# EAGLE design bucket (EAGLE 7.6.0)
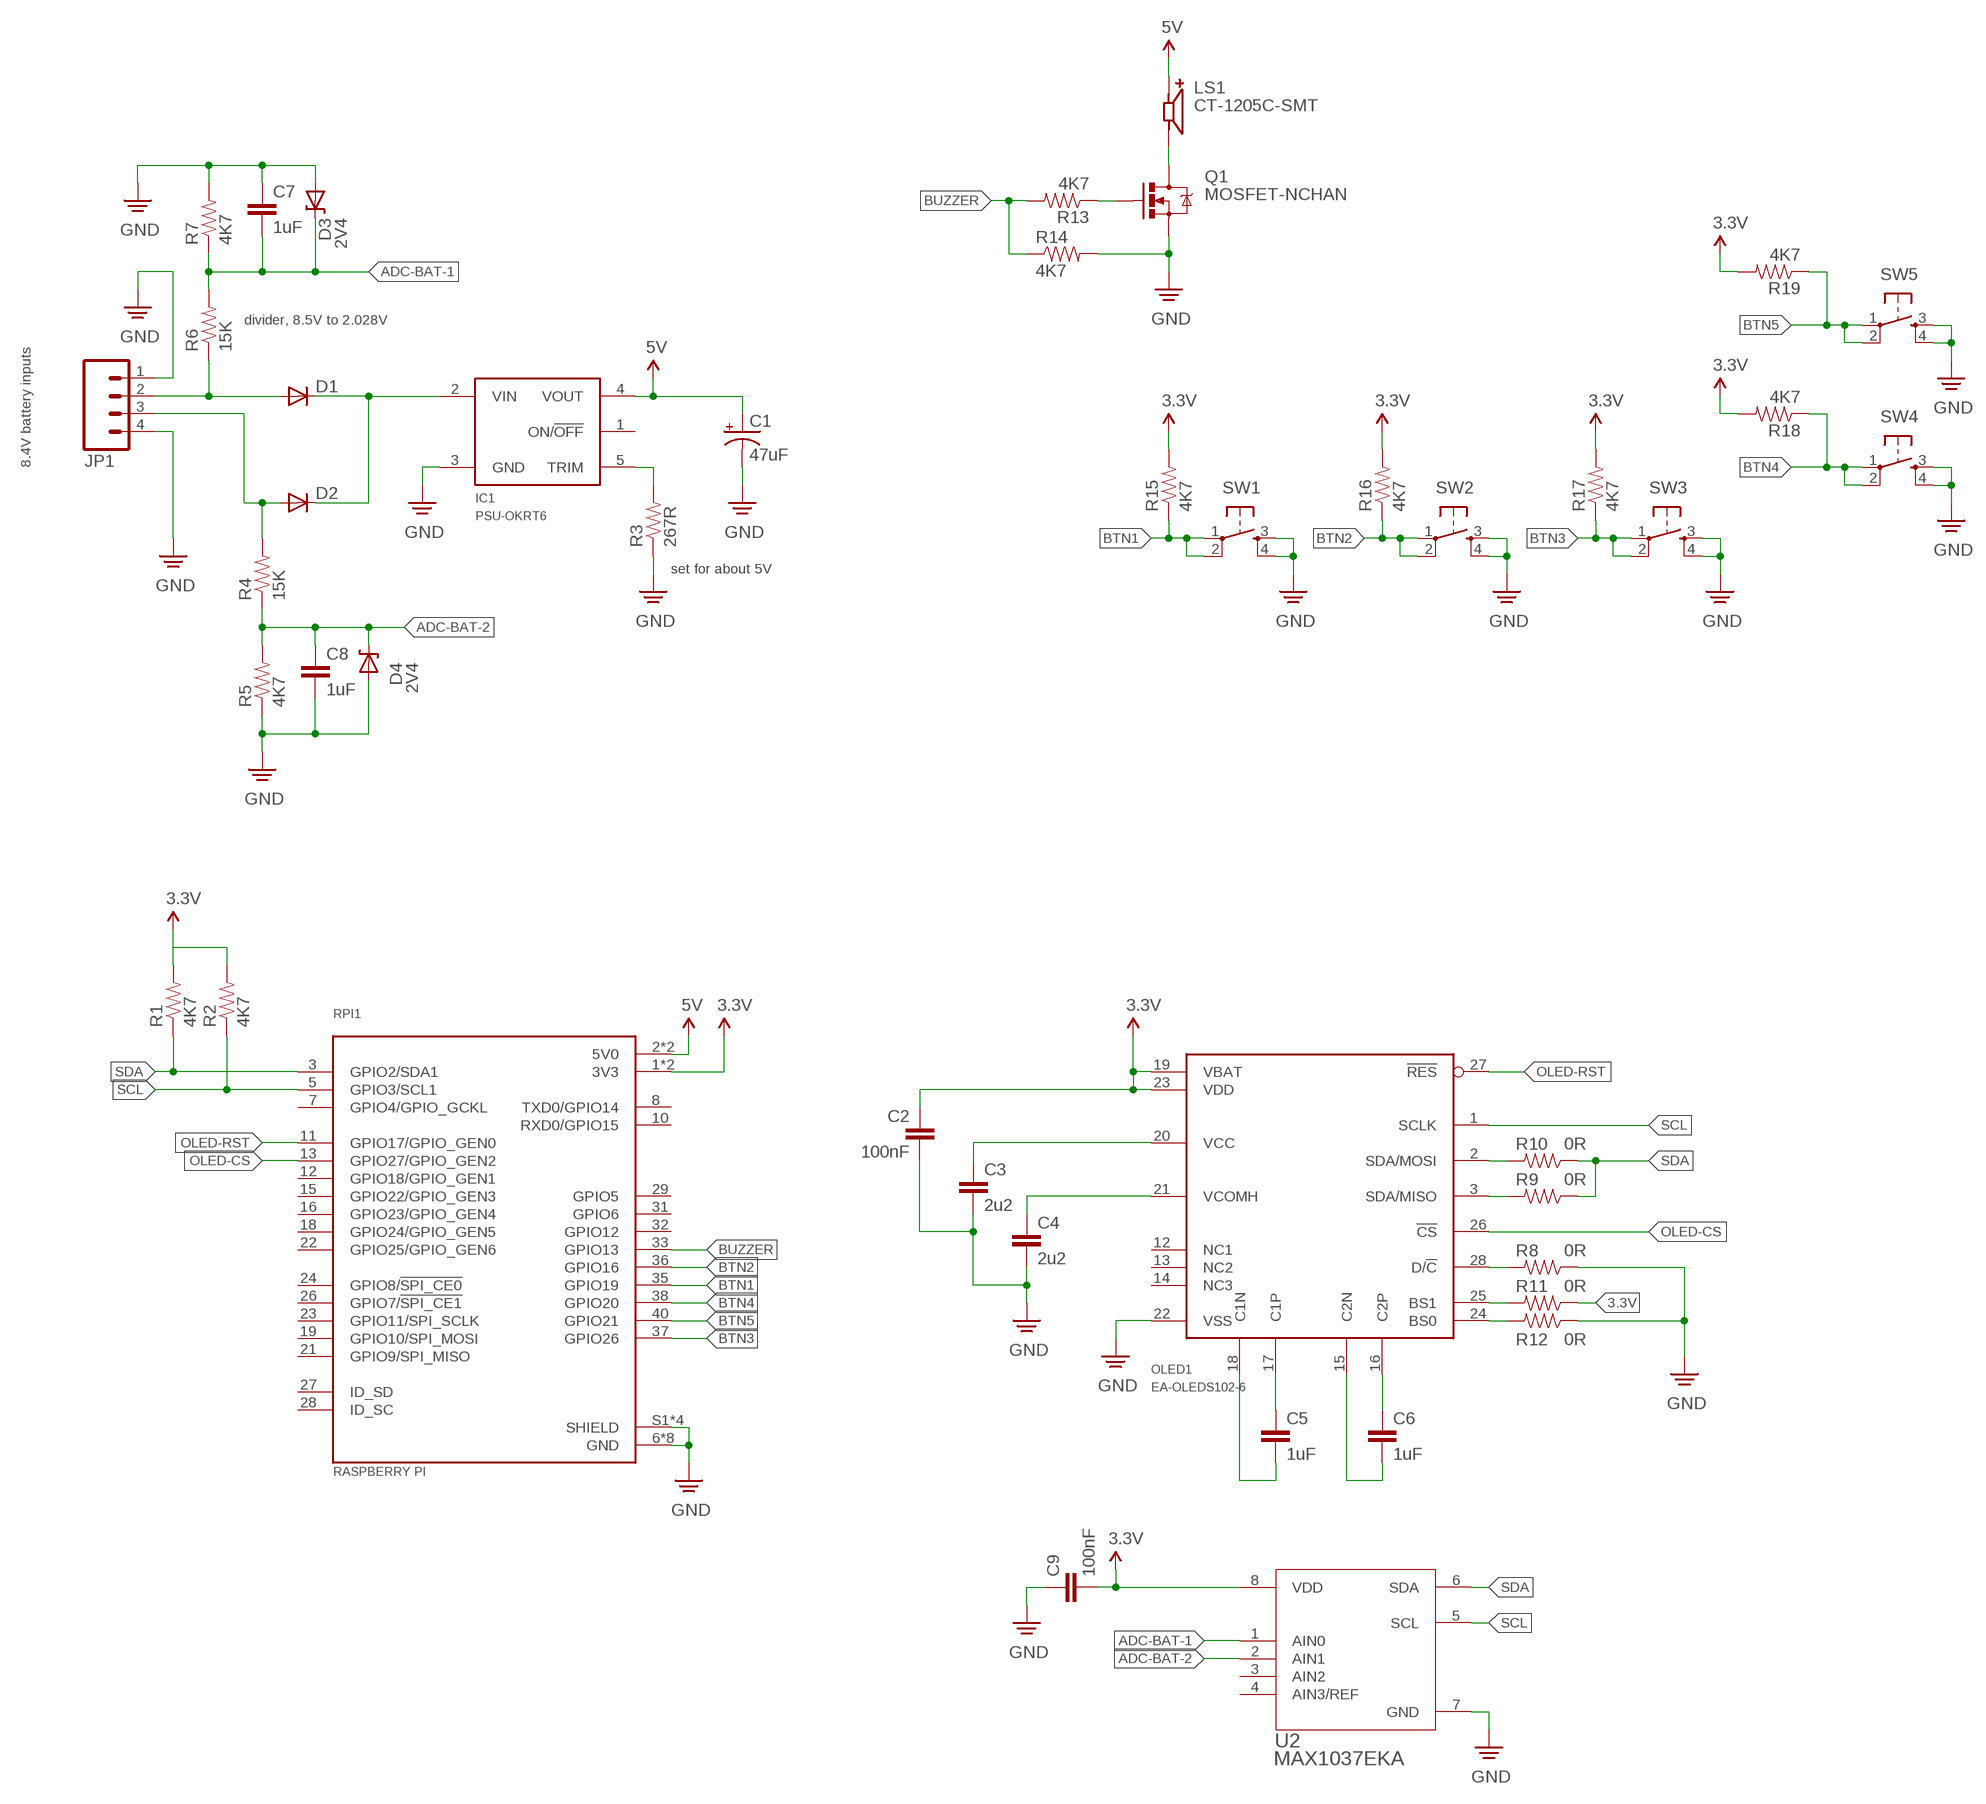
[diagram p0: schematic, sheet 1]

## Parts
C1  47uF  CAP_POLD  [PANASONIC_D]
C2  100nF  CAP0603-CAP  [0603-CAP]
C3  2u2  CAP0603-CAP  [0603-CAP]
C4  2u2  CAP0603-CAP  [0603-CAP]
C5  1uF  CAP0603-CAP  [0603-CAP]
C6  1uF  CAP0603-CAP  [0603-CAP]
C7  1uF  CAP0603-CAP  [0603-CAP]
C8  1uF  CAP0603-CAP  [0603-CAP]
C9  100nF  CAP0603-CAP  [0603-CAP]
D1  DIODESMB  [SMB-DIODE]
D2  DIODESMB  [SMB-DIODE]
D3  2V4  DIODE-ZENER-SOD323  [SOD-323]
D4  2V4  DIODE-ZENER-SOD323  [SOD-323]
IC1  PSU-OKRT6  [PSU-OKRT6]
JP1  M04-AMPMODUMTE-TH-ANG  [M04-AMPMODUMTE-TH-ANG]
LS1  CT-1205C-SMT  [CUI_CT-1205C-SMT]
OLED1  EA-OLEDS102-6  [EA-OLEDS102-6]
Q1  MOSFET-NCHAN  MOSFET-NCHANNELSMD  [SOT23-3]
R1  4K7  RESISTOR0603-RES  [0603-RES]
R2  4K7  RESISTOR0603-RES  [0603-RES]
R3  267R  RESISTOR0603-RES  [0603-RES]
R4  15K  RESISTOR0603-RES  [0603-RES]
R5  4K7  RESISTOR0603-RES  [0603-RES]
R6  15K  RESISTOR0603-RES  [0603-RES]
R7  4K7  RESISTOR0603-RES  [0603-RES]
R8  0R  RESISTOR0603-RES  [0603-RES]
R9  0R  RESISTOR0603-RES  [0603-RES]
R10  0R  RESISTOR0603-RES  [0603-RES]
R11  0R  RESISTOR0603-RES  [0603-RES]
R12  0R  RESISTOR0603-RES  [0603-RES]
R13  4K7  RESISTOR0603-RES  [0603-RES]
R14  4K7  RESISTOR0603-RES  [0603-RES]
R15  4K7  RESISTOR0603-RES  [0603-RES]
R16  4K7  RESISTOR0603-RES  [0603-RES]
R17  4K7  RESISTOR0603-RES  [0603-RES]
R18  4K7  RESISTOR0603-RES  [0603-RES]
R19  4K7  RESISTOR0603-RES  [0603-RES]
RPI1  RASPBERRY PI  RASPBERRY_PI_3_MODEL_B+  [MODULE_RASPBERRY_PI_3_MODEL_B+]
SW1  TAC_SWITCHPTH  [TACTILE-PTH]
SW2  TAC_SWITCHPTH  [TACTILE-PTH]
SW3  TAC_SWITCHPTH  [TACTILE-PTH]
SW4  TAC_SWITCHPTH  [TACTILE-PTH]
SW5  TAC_SWITCHPTH  [TACTILE-PTH]
U2  MAX1037EKA  [21-0078H]

## Nets
3.3V: C2.1 C9.2 OLED1.19(VBAT) OLED1.23(VDD) R1.2 R2.2 R11.1 R15.2 R16.2 R17.2 R18.2 R19.2 RPI1.1(3V3) RPI1.17(3V3) U2.8(VDD)
5V: C1.+ IC1.4(VOUT) LS1.1 RPI1.2(5V0) RPI1.4(5V0)
ADC-BAT-1: C7.2 D3.1(C) R6.2 R7.1 U2.1(AIN0)
ADC-BAT-2: C8.1 D4.1(C) R4.1 R5.2 U2.2(AIN1)
BTN1: R15.1 RPI1.35(GPIO19) SW1.1 SW1.2
BTN2: R16.1 RPI1.36(GPIO16) SW2.1 SW2.2
BTN3: R17.1 RPI1.37(GPIO26) SW3.1 SW3.2
BTN4: R18.1 RPI1.38(GPIO20) SW4.1 SW4.2
BTN5: R19.1 RPI1.40(GPIO21) SW5.1 SW5.2
BUZZER: R13.2 R14.1 RPI1.33(GPIO13)
GND: C1.- C2.2 C3.2 C4.2 C7.1 C8.2 C9.1 D3.2(A) D4.2(A) IC1.3(GND) JP1.1 JP1.4 OLED1.22(VSS) Q1.2(S) R3.1 R5.1 R7.2 R8.1 R12.1 R14.2 RPI1.6(GND) RPI1.9(GND) RPI1.14(GND) RPI1.20(GND) RPI1.25(GND) RPI1.30(GND) RPI1.34(GND) RPI1.39(GND) RPI1.S1(SHIELD) RPI1.S2(SHIELD) RPI1.S3(SHIELD) RPI1.S4(SHIELD) SW1.3 SW1.4 SW2.3 SW2.4 SW3.3 SW3.4 SW4.3 SW4.4 SW5.3 SW5.4 U2.7(GND)
N$1: D2.A JP1.3 R4.2
N$2: D1.A JP1.2 R6.1
N$3: D1.C D2.C IC1.2(VIN)
N$4: IC1.5(TRIM) R3.2
N$5: Q1.1(G) R13.1
N$6: LS1.2 Q1.3(D)
N$7: OLED1.28(D/!C) R8.2
N$9: OLED1.3(SDA/MISO) R9.2
N$10: OLED1.2(SDA/MOSI) R10.2
N$11: OLED1.25(BS1) R11.2
N$12: OLED1.24(BS0) R12.2
N$13: C4.1 OLED1.21(VCOMH)
N$14: C3.1 OLED1.20(VCC)
N$16: C5.2 OLED1.18(C1N)
N$17: C5.1 OLED1.17(C1P)
N$18: C6.1 OLED1.16(C2P)
N$19: C6.2 OLED1.15(C2N)
OLED-CS: OLED1.26(!CS) RPI1.13(GPIO27/GPIO_GEN2)
OLED-RST: OLED1.27(!RES) RPI1.11(GPIO17/GPIO_GEN0)
SCL: OLED1.1(SCLK) R2.1 RPI1.5(GPIO3/SCL1) U2.5(SCL)
SDA: R1.1 R9.1 R10.1 RPI1.3(GPIO2/SDA1) U2.6(SDA)
Unconnected: IC1.1(ON/!OFF) OLED1.12(NC1) OLED1.13(NC2) OLED1.14(NC3) RPI1.7(GPIO4/GPIO_GCKL) RPI1.8(TXD0/GPIO14) RPI1.10(RXD0/GPIO15) RPI1.12(GPIO18/GPIO_GEN1) RPI1.15(GPIO22/GPIO_GEN3) RPI1.16(GPIO23/GPIO_GEN4) RPI1.18(GPIO24/GPIO_GEN5) RPI1.19(GPIO10/SPI_MOSI) RPI1.21(GPIO9/SPI_MISO) RPI1.22(GPIO25/GPIO_GEN6) RPI1.23(GPIO11/SPI_SCLK) RPI1.24(GPIO8/!SPI_CE0!) RPI1.26(GPIO7/!SPI_CE1!) RPI1.27(ID_SD) RPI1.28(ID_SC) RPI1.29(GPIO5) RPI1.31(GPIO6) RPI1.32(GPIO12) U2.3(AIN2) U2.4(AIN3/REF)

## Notes on the sheet
- divider, 8.5V to 2.028V
- 8.4V battery inputs
- set for about 5V

## Library data of the parts
C1 = bucket:CAP_POL: Capacitor Polarized These are standard SMD and PTH capacitors. Normally 10uF, 47uF, and 100uF in electrolytic and tantalum varieties. Always verify the external diameter of the through hole cap, it varies with capacity, voltage, and manufacturer. The EIA devices should be standard.
C2-C9 = bucket:CAP: Capacitor Standard 0603 ceramic capacitor, and 0.1" leaded capacitor.
D1 D2 = bucket:DIODE: Diode These are standard reverse protection diodes and small signal diodes. SMA package can handle up to about 1A. SOD-323 can handle about 200mA. What the SOD-323 package when ordering, there are some mfgs out there that are 5-pin packages.
D3 D4 = bucket:DIODE-ZENER: Zener Diode Production Part - 8199 3.4V Zener Voltage
IC1 = bucket:PSU-OKRT6
JP1 = bucket:M04: Header 4 Standard 4-pin 0.1" header. Use with straight break away headers (SKU : PRT-00116), right angle break away headers (PRT-00553), swiss pins (PRT-00743), machine pins (PRT-00117), and female headers (PRT-00115). Molex polarized connector foot print use with SKU : PRT-08231 with associated crimp pins and housings. 1MM SMD Version SKU: PRT-10208
LS1 = bucket:CT-1205C-SMT: 12.8 mm, 5 V, 90 dB, 2.4 kHz, Surface Mount (SMT), Driving Circuit, Magnetic Audio Indicator Buzzer; DESCRIPTION: 12.8 mm, 5 V, 90 dB, 2.4 kHz, Surface Mount (SMT), Driving Circuit, Magnetic Audio Indicator Buzzer; MF: CUI DEVICES; MP: CT-1205C-SMT; PACKAGE: None
OLED1 = bucket:EA-OLEDS102-6
Q1 = bucket:MOSFET-NCHANNEL
R1-R19 = bucket:RESISTOR: Resistor Basic schematic elements and footprints for 0603, 1206, and PTH resistors.
RPI1 = bucket:RASPBERRY_PI_3_MODEL_B+: BCM2835 Raspberry Pi Model B+
SW1-SW5 = bucket:TAC_SWITCH: Momentary Switch Button commonly used for reset or general input. Spark Fun Electronics SKU : COM-00097
U2 = bucket:MAX1037EKA; DESCRIPTION: Analog to Digital Converters - ADC 2.7V to 5.5V, Low-Power, 4-/12-Channel 2-Wire Serial 8-Bit ADCs; MF: Maxim Integrated; MP: MAX1037EKA; PACKAGE: SOT-8 Maxim

## Board
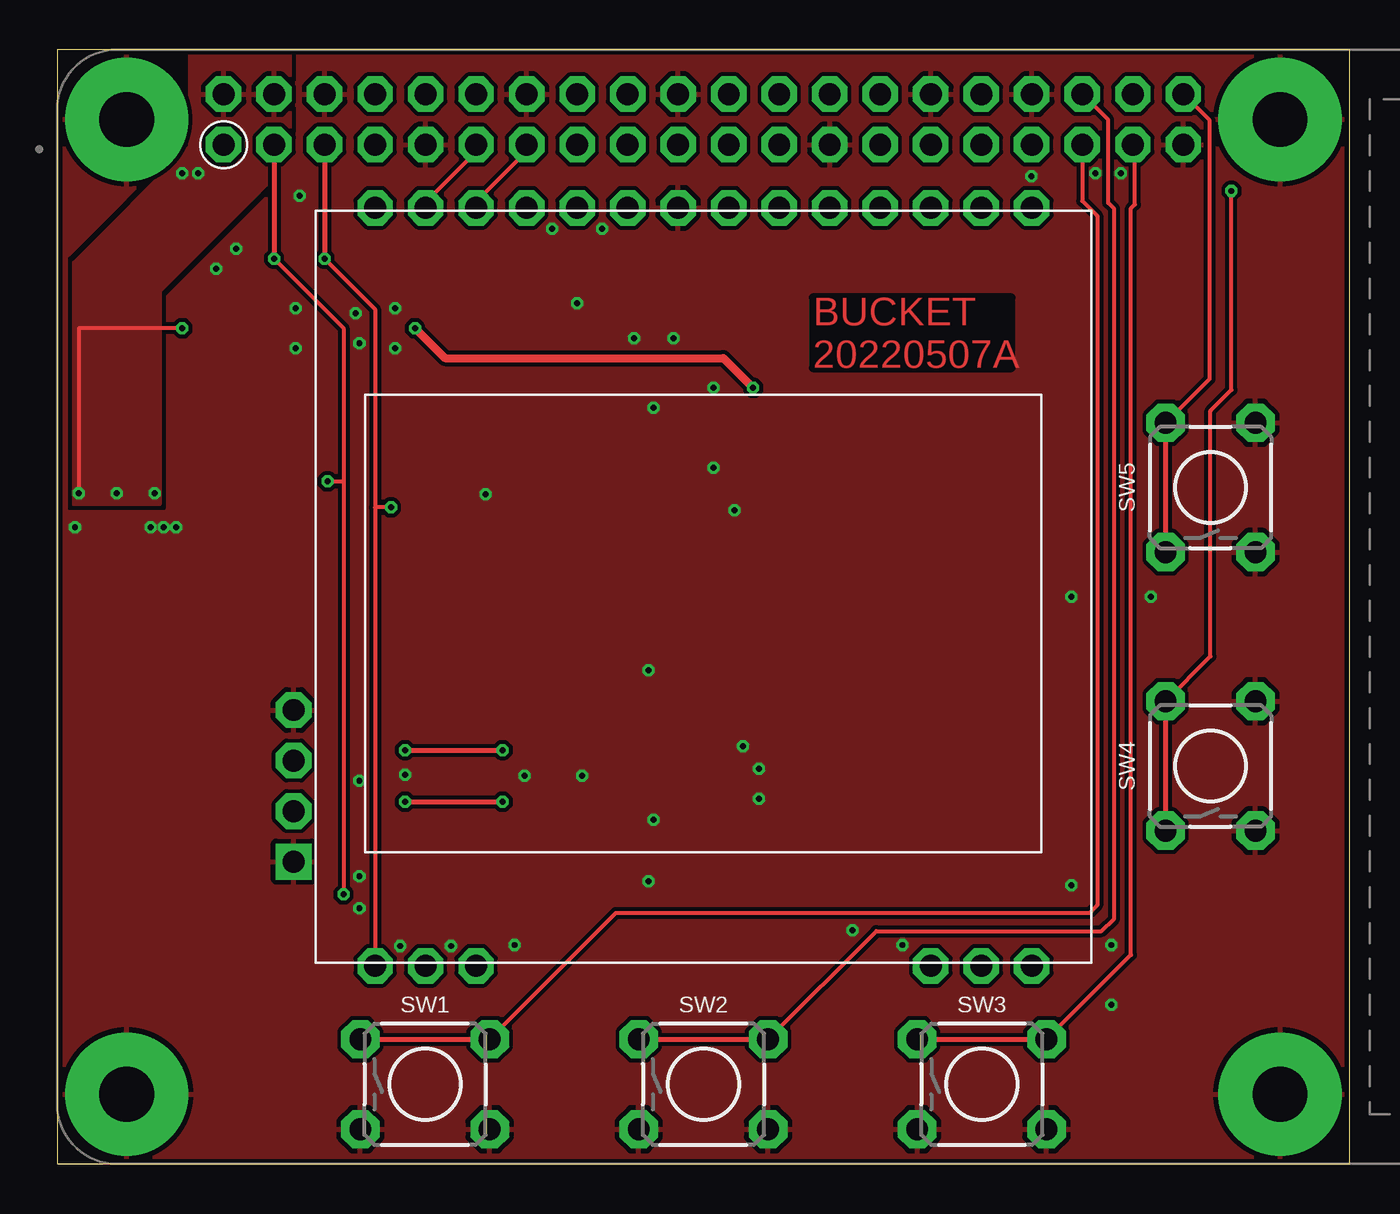
[diagram p1: board, top side]
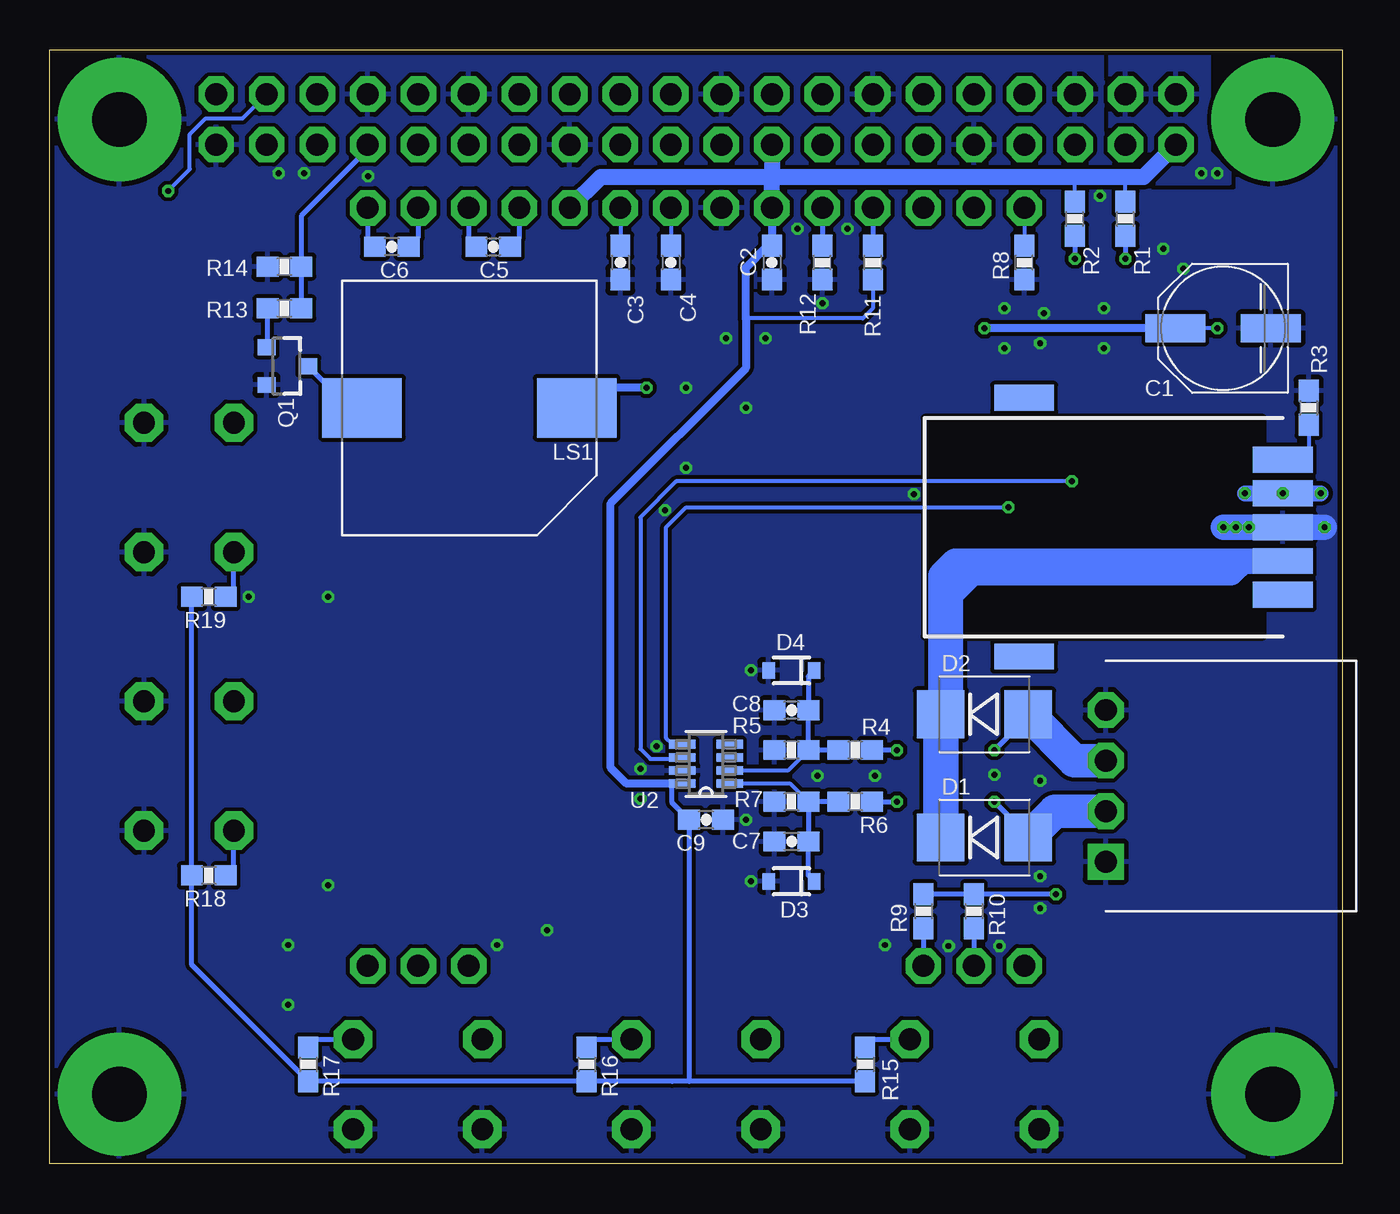
[diagram p2: board, bottom side, seen from below]

Size 65 x 56 mm. Coordinates in mm from the lower left corner, seen from the top.
Outline: 0,0 65,0 65,56 0,56 0,0
Copper layers (1*16): Top 0.035mm / dielectric 1.5mm / Bottom 0.035mm
Design rules "fusion-eagle-rule-tentedvias": minimum track width 6mil, minimum drill 0.3mm, track to track 6mil, track to pad 6mil, pad to pad 6mil, via to via 6mil, smd to smd 0mil, copper to edge 10mil, drill to drill 10mil, minimum pad ring 10mil, minimum via ring 6mil, stop-mask expansion 2mil, vias tented up to drill 25mil, thermal gap 10mil

### Footprints (pad centres in the part's own frame; a part is rotated, then mirrored left to right if it is on the bottom)
PANASONIC_D = smd 3 x 1.4: + 2.4,0; - -2.4,0
0603-CAP = smd 1.1 x 1: 1 -0.85,0; 2 0.85,0
SMB-DIODE = smd 2.4 x 2.4: A 2.2,0; C -2.2,0
SOD-323 = smd 0.63 x 0.83: 1 -1.15,0; 2 1.15,0
PSU-OKRT6 = smd 1.3 x 3: 1 -3.4,0; 2 -1.7,0; 3 0,0; 4 1.7,0; 5 3.4,0; 6 -6.5,13; 7 6.5,13
M04-AMPMODUMTE-TH-ANG = drill 1.1 pad 1.8 square: 1 -3.81,0 | drill 1.1 pad 1.8 octagon: 2 -1.27,0; 3 1.27,0; 4 3.81,0
CUI_CT-1205C-SMT = smd 4 x 3: 1 5.4,0; 2 -5.4,0
EA-OLEDS102-6 = drill 1.1 pad 1.778 octagon: 1 -16.51,-19.05; 2 -13.97,-19.05; 3 -11.43,-19.05; 12 11.43,-19.05; 13 13.97,-19.05; 14 16.51,-19.05; 15 16.51,19.05; 16 13.97,19.05; 17 11.43,19.05; 18 8.89,19.05; 19 6.35,19.05; 20 3.81,19.05; 21 1.27,19.05; 22 -1.27,19.05; 23 -3.81,19.05; 24 -6.35,19.05; 25 -8.89,19.05; 26 -11.43,19.05; 27 -13.97,19.05; 28 -16.51,19.05
SOT23-3 = smd 0.8 x 0.9: 1 -0.95,-1; 2 0.95,-1; 3 0,1.1
0603-RES = smd 1.1 x 1: 1 -0.85,0; 2 0.85,0
MODULE_RASPBERRY_PI_3_MODEL_B+ = drill 1.1 pad 1.778 octagon: 1 -34.13,23.23; 2 -34.13,25.77; 3 -31.59,23.23; 4 -31.59,25.77; 5 -29.05,23.23; 6 -29.05,25.77; 7 -26.51,23.23; 8 -26.51,25.77; 9 -23.97,23.23; 10 -23.97,25.77; 11 -21.43,23.23; 12 -21.43,25.77; 13 -18.89,23.23; 14 -18.89,25.77; 15 -16.35,23.23; 16 -16.35,25.77; 17 -13.81,23.23; 18 -13.81,25.77; 19 -11.27,23.23; 20 -11.27,25.77; 21 -8.73,23.23; 22 -8.73,25.77; 23 -6.19,23.23; 24 -6.19,25.77; 25 -3.65,23.23; 26 -3.65,25.77; 27 -1.11,23.23; 28 -1.11,25.77; 29 1.43,23.23; 30 1.43,25.77; 31 3.97,23.23; 32 3.97,25.77; 33 6.51,23.23; 34 6.51,25.77; 35 9.05,23.23; 36 9.05,25.77; 37 11.59,23.23; 38 11.59,25.77; 39 14.13,23.23; 40 14.13,25.77 | drill 2.75 pad 6.2: S1 -39,24.5; S2 19,24.5; S3 19,-24.5; S4 -39,-24.5
TACTILE-PTH = drill 1.1 pad 1.93 octagon: 1 -3.251,2.261; 2 3.251,2.261; 3 -3.251,-2.261; 4 3.251,-2.261
21-0078H = smd 1.321 x 0.432: 1 -1.194,0.991; 2 -1.194,0.33; 3 -1.194,-0.33; 4 -1.194,-0.991; 5 1.194,-0.991; 6 1.194,-0.33; 7 1.194,0.33; 8 1.194,0.991

### Placement (x,y rotation side)
C1  6,42 180 bottom
C2  28.69,45.3 270 bottom
C3  36.31,45.3 270 bottom
C4  33.77,45.3 270 bottom
C5  42.7,46.1 0 bottom
C6  47.8,46.1 180 bottom
C7  27.7,16.2 0 bottom
C8  27.7,22.8 180 bottom
C9  32,17.3 180 bottom
D1  18,16.4 0 bottom
D2  18,22.6 0 bottom
D3  27.7,14.2 180 bottom
D4  27.7,24.8 180 bottom
IC1  3,32 90 bottom
JP1  11.9,19 90 bottom
LS1  43.9,38 0 bottom
OLED1  32.5,29 0 top
Q1  53.1,40.1 270 bottom
R1  10.91,47.5 90 bottom
R2  13.45,47.5 90 bottom
R3  1.7,38 270 bottom
R4  24.5,20.8 0 bottom
R5  27.7,20.8 0 bottom
R6  24.5,18.2 180 bottom
R7  27.7,18.2 180 bottom
R8  16,45.3 90 bottom
R9  21.07,12.7 270 bottom
R10  18.53,12.7 270 bottom
R11  23.61,45.3 90 bottom
R12  26.15,45.3 90 bottom
R13  53.2,43 0 bottom
R14  53.2,45.1 180 bottom
R15  24,5 270 bottom
R16  38,5 270 bottom
R17  52,5 270 bottom
R18  57,14.5 180 bottom
R19  57,28.5 180 bottom
RPI1  42.5,28 0 top
SW1  18.5,4 0 top
SW2  32.5,4 0 top
SW3  46.5,4 0 top
SW4  58,20 90 top
SW5  58,34 90 top
U2  32,20.1 180 bottom

### Tracks (layer width: path | path; a pad name or v marks a point on that pad's centre or on a via)
3.3V
  Bottom 0.203: R1.2 10.91,49.6 11.1,49.6 | R2.2 13.45,49.6 13.9,49.6 | R11.1 23.61,43 24.11,42.5 30,42.5
  Bottom 0.254: R15.2 32.85,4.15 | R19.2 R18.2 57.85,10 R17.2 R16.2 33.7,4.15 32.85,4.15 | 33.7,19.11 33.7,18.15 C9.2 32.85,4.15
  Bottom 0.406: OLED1.23 C2.1 28.9,46.15 30,45.05 30,42.5 30,40 36.8,33.2 36.8,19.92 35.99,19.11 33.7,19.11 U2.8
  Bottom 0.813: RPI1.1 10,49.6 11.1,49.6 13.9,49.6 28.69,49.6 | 28.69,49.6 37.3,49.6 OLED1.19 | RPI1.17 28.69,49.6 | OLED1.23 28.69,49.6
5V  (via drill 0.3)
  Top 0.203: v6.3,42 1.1,42 v1.1,33.7
  Top 0.406: v18,42 19.5,40.5 33.5,40.5 v35,39
  Bottom 0.203: v6.3,42 C1.+
  Bottom 0.406: C1.+ v18,42 | v35,39 37.5,39 LS1.1
  Bottom 0.813: IC1.4 v1.1,33.7 | v4.9,33.7 3.2,33.7
  other vias: 7.1,49.8 6.3,49.8 3,33.7
  pour Top (isolate 0.203): 6.7,56 11.7,56 11.7,50.4 5.15,43.85 5.15,33.15 0.85,33.15 0.85,45.3 6.7,51.15
  pour Bottom (isolate 0.203): 11.7,56 11.7,49.3 5.65,49.3 5.65,49.8 6.7,50.85 6.7,56
ADC-BAT-1
  Bottom 0.203: R7.1 27.75,19.1 30.8,19.1 U2.1
  Bottom 0.254: R6.2 R7.1 C7.2 26.85,14.5 D3.1
ADC-BAT-2
  Bottom 0.203: R5.2 27.88,19.77 U2.2 | 26.85,22.3 C8.1
  Bottom 0.254: R4.1 R5.2 26.85,22.3 | D4.1 26.85,24.5 C8.1
BTN1
  Top 0.203: SW1.2 28.09,12.6 51.9,12.6 52.3,13 52.3,47.65 51.55,48.4 RPI1.35
  Top 0.254: SW1.1 SW1.2
  Bottom 0.203: R15.1 23.59,6.26
  Bottom 0.254: 23.59,6.26 SW1.2
BTN2
  Top 0.203: SW2.2 41.19,11.7 52.52,11.7 53.15,12.33 53.15,48 52.85,48.3 52.85,52.47 RPI1.36
  Top 0.254: SW2.1 SW2.2
  Bottom 0.203: R16.1 37.59,6.26
  Bottom 0.254: 37.59,6.26 SW2.2
BTN3
  Top 0.203: SW3.2 54,10.51 54,48.03 54.2,48.23 54.2,51.17 RPI1.37
  Top 0.254: SW3.1 SW3.2
  Bottom 0.203: R17.1 51.59,6.26
  Bottom 0.254: 51.59,6.26 SW3.2
BTN4  (via drill 0.3)
  Top 0.203: SW4.2 58,25.51 58,37.85 59.05,38.9 v59.05,48.9
  Top 0.254: SW4.1 SW4.2
  Bottom 0.203: v59.05,48.9 57.95,50 57.95,51.75 57.15,52.55 55.31,52.55 RPI1.38 | R18.1 55.74,14.91
  Bottom 0.254: 55.74,14.91 SW4.1
BTN5
  Top 0.203: SW5.2 57.95,39.46 57.95,52.45 RPI1.40
  Top 0.254: SW5.1 SW5.2
  Bottom 0.203: R19.1 55.74,28.91
  Bottom 0.254: 55.74,28.91 SW5.1
BUZZER
  Bottom 0.203: RPI1.33 49.01,50.99
  Bottom 0.254: 49.01,50.99 52.35,47.65 R14.1 R13.2
GND  (via drill 0.3)
  Bottom 1.27: v0.9,32 2.45,32 | 3.5,32 v6,32
  other vias: 53.5,49.8 52.2,49.8 12.2,48.65 27.4,47 24.9,47 26.15,43.25 5.35,32 4.7,32 34.5,21 21.55,33.65 15,42.75 15.2,41.25 15.2,19.25 15.2,14.45 15.2,12.85 34.05,32.85 35.3,19.85 30,17.3 33,35 17,41 17,43 12,43 12,41 8,45 9,46 17.5,19.55 23.5,19.5 26.4,19.5 29.75,24.8 29.75,14.2 17.25,10.95 19.8,10.95 23,11 40,11.75 42.5,11 51,14 53,11 53,8 29,41.5 31,41.5 33,39 30,38 49,49.65 55,28.5 51,28.5 35.3,18.35
  pour Top (isolate 0.203, rank 5): 0,0 65,0 65,56 0,56
  pour Bottom (isolate 0.203, rank 5): 0,0 65,0 65,56 0,56
N$1  (via drill 0.3)
  Top 0.254: v17.5,20.8 v22.4,20.8
  Bottom 0.203: 15.8,22.5 D2.A
  Bottom 0.254: v17.5,20.8 15.8,22.5 | v22.4,20.8 R4.2
  Bottom 1.676: JP1.3 13.47,20.27 D2.A
N$2  (via drill 0.3)
  Top 0.254: v17.5,18.2 v22.4,18.2
  Bottom 0.203: 15.8,16.5 D1.A
  Bottom 0.254: v17.5,18.2 15.8,16.5 | R6.1 v22.4,18.2
  Bottom 1.676: JP1.2 14.47,17.73 D1.A
N$3
  Bottom 1.27: IC1.2 5,30.3 | 5,30.3 19.48,30.3 20.2,29.58 D2.C | 19.7,23.3 19.7,28.62 18.62,29.7 5.6,29.7 5,30.3
  Bottom 1.778: D1.C D2.C
N$4
  Bottom 0.203: R3.2 1.7,35.4 IC1.5
N$5
  Bottom 0.203: Q1.1 54.05,41.1
  Bottom 0.254: 54.05,41.1 R13.1
N$6
  Bottom 0.203: 49.6,37.7 48.8,37.7 49.1,38 LS1.2
  Bottom 0.254: Q1.3 49.6,37.7
N$7
  Bottom 0.203: OLED1.28 R8.2
N$9
  Bottom 0.254: R9.2 OLED1.3
N$10
  Bottom 0.254: R10.2 OLED1.2
N$11
  Bottom 0.254: OLED1.25 R11.2
N$12
  Bottom 0.254: OLED1.24 R12.2
N$13
  Bottom 0.203: OLED1.21 C4.1
N$14
  Bottom 0.203: OLED1.20 C3.1
N$16
  Bottom 0.203: 41.39,46.56 C5.2
  Bottom 0.254: OLED1.18 41.39,46.56
N$17
  Bottom 0.203: 43.93,46.48 C5.1
  Bottom 0.254: OLED1.17 43.93,46.48
N$18
  Bottom 0.203: 46.47,46.58 C6.1
  Bottom 0.254: OLED1.16 46.47,46.58
N$19
  Bottom 0.203: 49.01,46.46 C6.2
  Bottom 0.254: OLED1.15 49.01,46.46
OLED-CS
  Top 0.203: OLED1.26 21.07,48.37 23.61,50.91 RPI1.13
OLED-RST
  Top 0.203: OLED1.27 18.53,48.33 21.07,50.87 RPI1.11
SCL  (via drill 0.3)
  Top 0.203: 15.99,33 15.99,42.96 v13.45,45.5 | 15.99,33 OLED1.1 | v16.79,33 15.99,33
  Top 0.254: RPI1.5 v13.45,45.5
  Bottom 0.203: U2.5 33.69,21.09 34,21.4 34,32 33,33 v16.79,33
  Bottom 0.254: R2.1 v13.45,45.5
SDA  (via drill 0.3)
  Top 0.203: 14.4,34.3 14.4,42.01 v10.91,45.5 | 14.4,34.3 v14.4,13.55 | v13.6,34.3 14.4,34.3
  Top 0.254: RPI1.3 v10.91,45.5
  Bottom 0.203: v13.6,34.3 33.5,34.3 35.3,32.5 35.3,20.85 34.8,20.35 33.19,20.35 U2.6
  Bottom 0.254: R1.1 v10.91,45.5 | R9.1 R10.1 v14.4,13.55

### Text on the board
Top: BUCKET / 20220507A